# EAGLE design PCB (EAGLE 9.2.2)
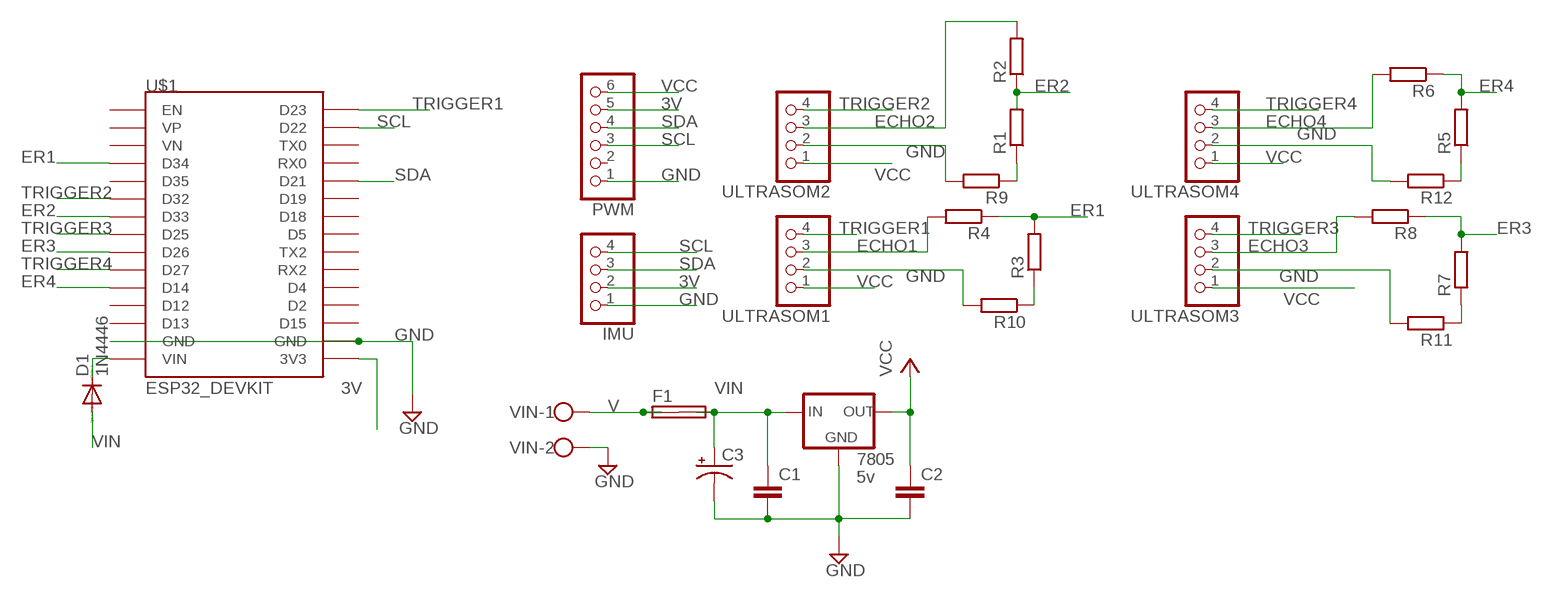
[diagram p0: schematic, sheet 1]

## Parts
7805  5v  78MXXS  [78MXXS]
C1  C-EU025-024X044  [C025-024X044]
C2  C-EU025-024X044  [C025-024X044]
C3  CPOL-USE2-5  [E2-5]
D1  1N4446  [DO35-10]
F1  SHK20L  [SHK20L]
IMU  PINHD-1X4  [1X04]
PWM  PINHD-1X6  [1X06]
R1  R-EU_0207/7  [0207/7]
R2  R-EU_0207/7  [0207/7]
R3  R-EU_0207/7  [0207/7]
R4  R-EU_0207/7  [0207/7]
R5  R-EU_0207/7  [0207/7]
R6  R-EU_0207/7  [0207/7]
R7  R-EU_0207/7  [0207/7]
R8  R-EU_0207/7  [0207/7]
R9  R-EU_0207/7  [0207/7]
R10  R-EU_0207/7  [0207/7]
R11  R-EU_0207/7  [0207/7]
R12  R-EU_0207/7  [0207/7]
U$1  ESP32_DEVKIT  [ESP32_DEVKIT]
ULTRASOM1  PINHD-1X4  [1X04]
ULTRASOM2  PINHD-1X4  [1X04]
ULTRASOM3  PINHD-1X4  [1X04]
ULTRASOM4  PINHD-1X4  [1X04]
VIN  W237-102  [W237-102]

## Nets
3V: IMU.2 PWM.5 U$1.3V3
ECHO1: R4.2 ULTRASOM1.3
ECHO2: R2.2 ULTRASOM2.3
ECHO3: R8.2 ULTRASOM3.3
ECHO4: R6.2 ULTRASOM4.3
ER1: R3.2 R4.1 U$1.D34
ER2: R1.2 R2.1 U$1.D33
ER3: R7.2 R8.1 U$1.D26
ER4: R5.2 R6.1 U$1.D14
GND: 7805.GND C1.2 C2.2 C3.- IMU.1 PWM.1 R9.2 R10.2 R11.2 R12.2 U$1.GND@1(GND) U$1.GND@2(GND) ULTRASOM1.2 ULTRASOM2.2 ULTRASOM3.2 ULTRASOM4.2 VIN.2
N$1: D1.C U$1.VIN
N$3: R5.1 R12.1
N$4: R7.1 R11.1
N$5: R3.1 R10.1
N$6: R1.1 R9.1
SCL: IMU.4 PWM.3 U$1.D22
SDA: IMU.3 PWM.4 U$1.D21
TRIGGER1: U$1.D23 ULTRASOM1.4
TRIGGER2: U$1.D32 ULTRASOM2.4
TRIGGER3: U$1.D25 ULTRASOM3.4
TRIGGER4: U$1.D27 ULTRASOM4.4
V: F1.1A F1.1B VIN.1
VCC: 7805.OUT C2.1 PWM.6 ULTRASOM1.1 ULTRASOM2.1 ULTRASOM3.1 ULTRASOM4.1
VIN: 7805.IN C1.1 C3.+ D1.A F1.2A F1.2B
Unconnected: PWM.2 U$1.D2 U$1.D4 U$1.D5 U$1.D12 U$1.D13 U$1.D15 U$1.D18 U$1.D19 U$1.D35 U$1.EN U$1.RX0 U$1.RX2 U$1.TX0 U$1.TX2 U$1.VN U$1.VP

## Library data of the parts
7805 = v-reg:78MXXS: VOLTAGE REGULATOR
C1 C2 = rcl:C-EU: CAPACITOR, European symbol; SPICEPREFIX: C
C3 = rcl:CPOL-US: POLARIZED CAPACITOR, American symbol; SPICEPREFIX: C
D1 = diode:1N4446: DIODE high speed (Philips)
F1 = fuse:SHK20L: FUSE HOLDER 5 x 20 mm, SH contact, SHH1 Schukat, E1073 Buerklin; OC_FARNELL: unknown; OC_NEWARK: unknown
IMU ULTRASOM1-ULTRASOM4 = pinhead:PINHD-1X4: PIN HEADER
PWM = pinhead:PINHD-1X6: PIN HEADER
R1-R12 = rcl:R-EU_: RESISTOR, European symbol; SPICEPREFIX: R
U$1 = DOIT_ESP32_DEVKIT:ESP32_DEVKIT: ESP32 DEVKIT BOARD
VIN = con-wago-500:W237-102: WAGO SCREW CLAMP; MPN: 237-102; OC_FARNELL: unknown; OC_NEWARK: 70K9898

## Board
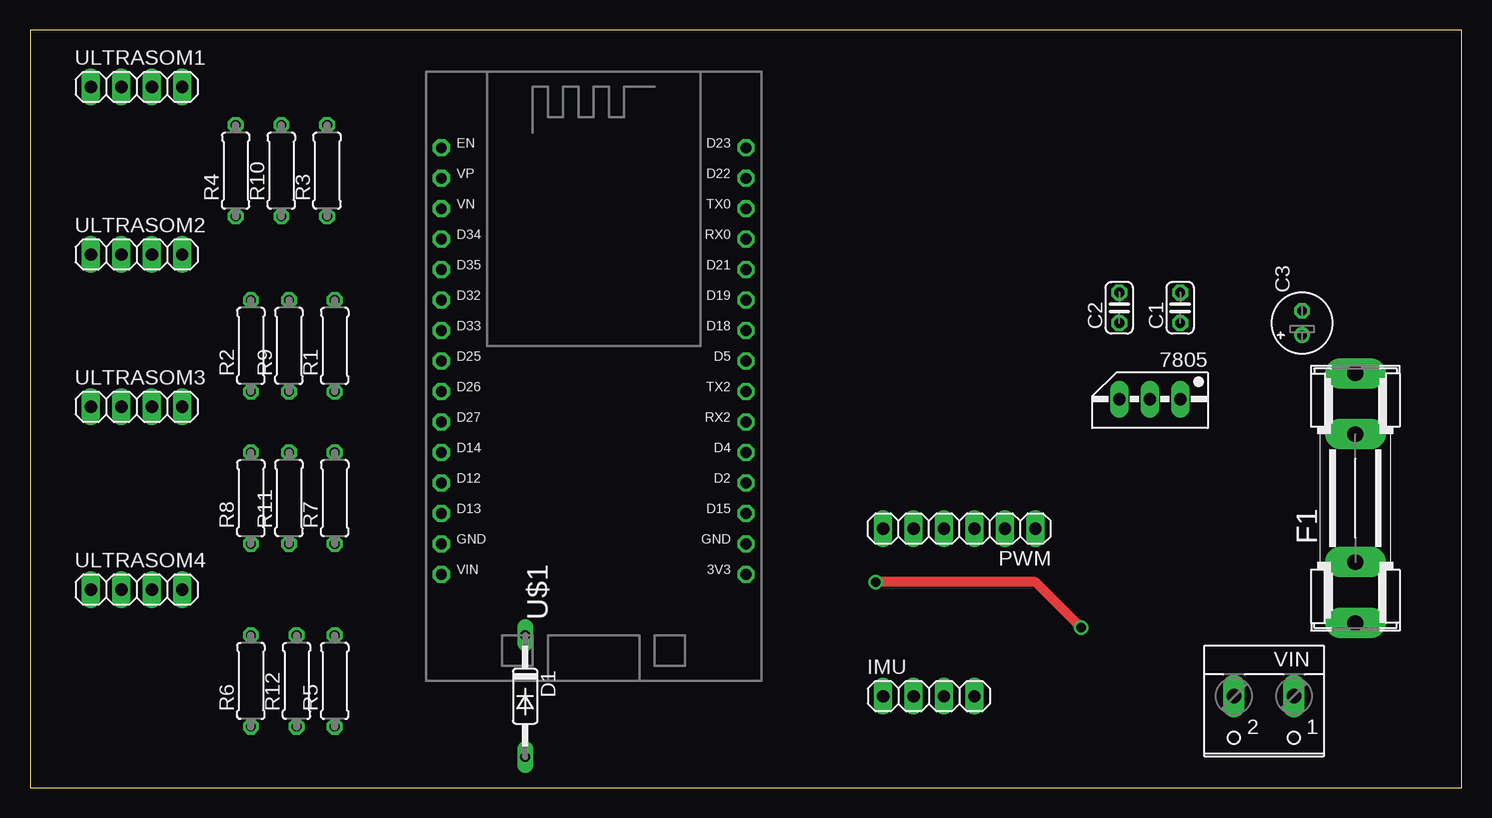
[diagram p1: board, top side]
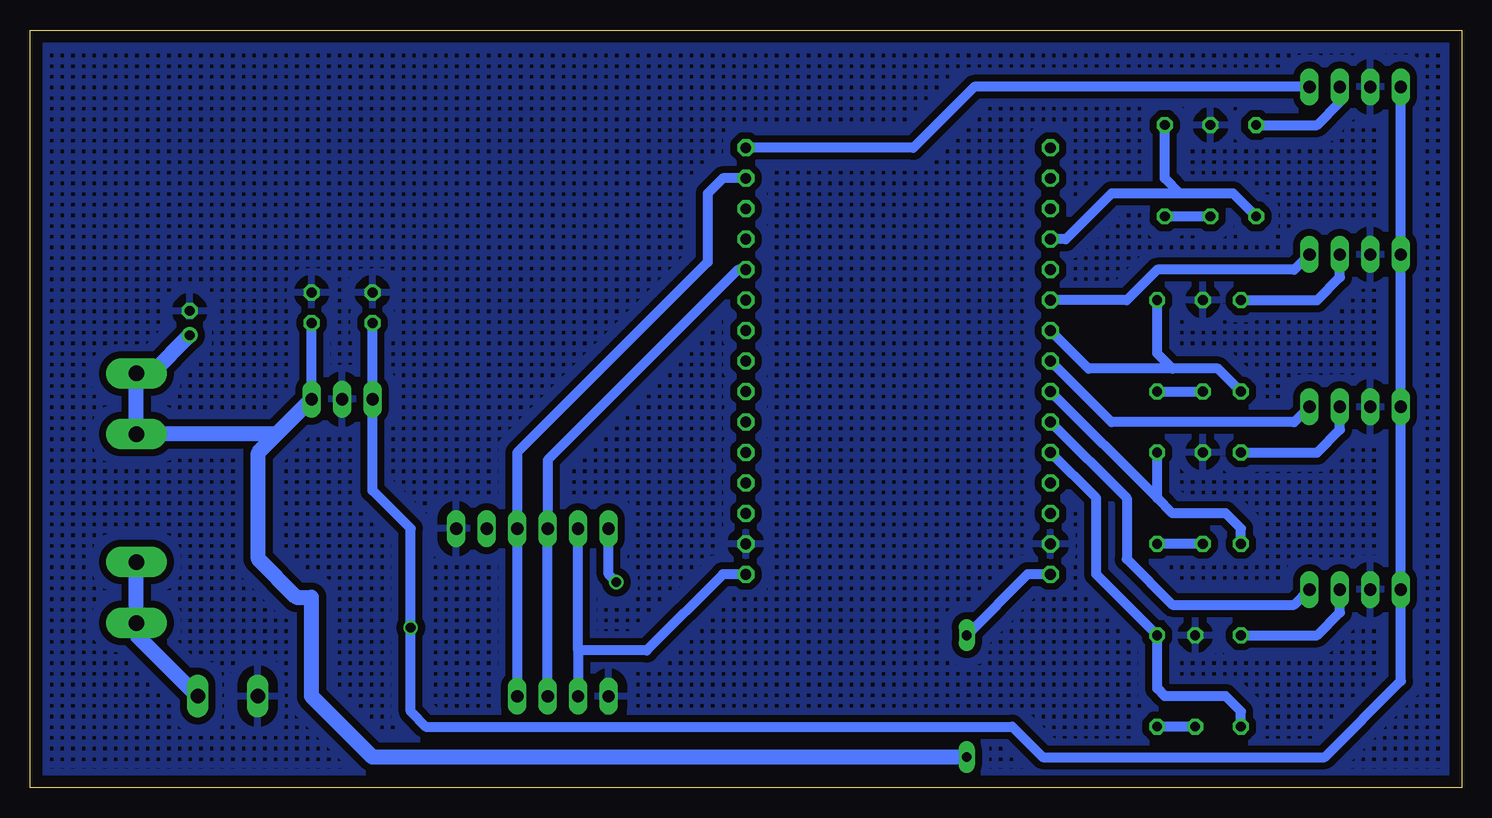
[diagram p2: board, bottom side, seen from below]

Size 119.36 x 63.17 mm. Coordinates in mm from the lower left corner, seen from the top.
Outline: 0,0 119.36,0 119.36,63.17 0,63.17 0,0
Copper layers (1*16): Top 0.035mm / dielectric 1.5mm / Bottom 0.035mm
Design rules "default *": minimum track width 0.8mm, minimum drill 0.8mm, track to track 0.4mm, track to pad 0.4mm, pad to pad 0.4mm, via to via 0.4mm, smd to smd 6mil, copper to edge 40mil, drill to drill 6mil, minimum pad ring 10mil, minimum via ring 8mil, stop-mask expansion 4mil, vias tented up to drill 0mil, thermal gap 0.8mm

### Footprints (pad centres in the part's own frame; a part is rotated, then mirrored left to right if it is on the bottom)
78MXXS = drill 1.016 long: GND 0,-2.54; IN -2.54,-2.54; OUT 2.54,-2.54
C025-024X044 = drill 0.813 octagon: 1 -1.27,0; 2 1.27,0
E2-5 = drill 0.813 pad 1.27: + -1.016,0 | drill 0.813 pad 1.27 octagon: - 1.016,0
DO35-10 = drill 0.813 long: A 5.08,0; C -5.08,0
SHK20L = drill 1.321 pad 2.54 long: 1A -10.414,0; 1B -5.334,0; 2A 10.414,0; 2B 5.334,0
1X04 = drill 1.016 long: 1 -3.81,0; 2 -1.27,0; 3 1.27,0; 4 3.81,0
1X06 = drill 1.016 long: 1 -6.35,0; 2 -3.81,0; 3 -1.27,0; 4 1.27,0; 5 3.81,0; 6 6.35,0
0207/7 = drill 0.813 octagon: 1 -3.81,0; 2 3.81,0
ESP32_DEVKIT = drill 0.9 pad 1.422 octagon: 3V3 11.43,-17.78; D2 11.43,-10.16; D4 11.43,-7.62; D5 11.43,0; D12 -13.97,-10.16; D13 -13.97,-12.7; D14 -13.97,-7.62; D15 11.43,-12.7; D18 11.43,2.54; D19 11.43,5.08; D21 11.43,7.62; D22 11.43,15.24; D23 11.43,17.78; D25 -13.97,0; D26 -13.97,-2.54; D27 -13.97,-5.08; D32 -13.97,5.08; D33 -13.97,2.54; D34 -13.97,10.16; D35 -13.97,7.62; EN -13.97,17.78; GND@1 -13.97,-15.24; GND@2 11.43,-15.24; RX0 11.43,10.16; RX2 11.43,-5.08; TX0 11.43,12.7; TX2 11.43,-2.54; VIN -13.97,-17.78; VN -13.97,12.7; VP -13.97,15.24
W237-102 = drill 1.194 long: 1 -2.5,-1.27; 2 2.5,-1.27

### Placement (x,y rotation side)
7805  93.34,29.84 180 top
C1  95.88,40.01 90 top
C2  90.8,40.01 90 top
C3  106.05,38.73 90 top
D1  41.28,7.62 270 top
F1  110.49,24.13 90 top
IMU  74.93,7.62 0 top
PWM  77.47,21.59 180 top
R1  25.4,36.83 90 top
R2  18.42,36.83 90 top
R3  24.76,51.44 90 top
R4  17.14,51.44 90 top
R5  25.4,8.89 90 top
R6  18.42,8.89 90 top
R7  25.4,24.13 90 top
R8  18.42,24.13 90 top
R9  21.59,36.83 90 top
R10  20.96,51.44 90 top
R11  21.59,24.13 90 top
R12  22.22,8.89 90 top
U$1  48.26,35.56 0 top
ULTRASOM1  8.89,58.42 0 top
ULTRASOM2  8.89,44.45 0 top
ULTRASOM3  8.89,31.75 0 top
ULTRASOM4  8.89,16.51 0 top
VIN  102.87,6.35 180 top

### Tracks (layer width: path | path; a pad name or v marks a point on that pad's centre or on a via)
3V
  Bottom 0.813: U$1.3V3 61.59,17.78 67.94,11.43 73.66,11.43 | 73.66,11.43 IMU.2 | 73.66,11.43 PWM.5
ECHO1
  Bottom 0.813: R4.2 12.07,55.24 10.16,57.15 ULTRASOM1.3
ECHO2
  Bottom 0.813: R2.2 14.61,40.64 12.07,40.64 10.16,42.55 ULTRASOM2.3
ECHO3
  Bottom 0.813: ULTRASOM3.3 10.16,29.84 12.07,27.94 R8.2
ECHO4
  Bottom 0.813: ULTRASOM4.3 10.16,14.61 12.07,12.7 R6.2
ER1
  Bottom 0.813: R4.1 19.05,49.53 23.5,49.53 | 23.5,49.53 24.76,50.8 R3.2 | 23.5,49.53 29.21,49.53 33.02,45.72 U$1.D34
ER2
  Bottom 0.813: R2.1 20.32,34.93 24.13,34.93 | 24.13,34.93 25.4,36.2 R1.2 | 24.13,34.93 31.11,34.93 U$1.D33
ER3
  Bottom 0.813: R8.1 18.42,21.59 19.68,22.86 24.13,22.86 25.4,24.13 | 25.4,24.13 R7.2 | 25.4,24.13 U$1.D26
ER4
  Bottom 0.813: U$1.D14 30.48,24.13 30.48,17.78 R5.2 25.4,8.25 24.76,7.62 19.68,7.62 18.42,6.35 R6.1
GND
  pour Bottom (isolate 0.584, hatched): 0,62.87 0,0 119.38,0 119.38,62.87
N$1
  Bottom 0.813: U$1.VIN 36.19,17.78 D1.C
N$3
  Bottom 0.813: R12.1 R5.1
N$4
  Bottom 0.813: R11.1 R7.1
N$5
  Bottom 0.813: R10.1 R3.1
N$6
  Bottom 0.813: R1.1 R9.1
SCL
  Bottom 0.813: IMU.4 PWM.3 78.74,27.94 62.86,43.81 62.86,49.53 61.59,50.8 U$1.D22
SDA
  Bottom 0.813: IMU.3 PWM.4 76.2,27.3 60.33,43.18 U$1.D21
TRIGGER1
  Bottom 0.813: ULTRASOM1.4 40.64,58.42 45.72,53.34 U$1.D23
TRIGGER2
  Bottom 0.813: ULTRASOM2.4 13.97,43.18 25.4,43.18 27.94,40.64 U$1.D32
TRIGGER3
  Bottom 0.813: ULTRASOM3.4 13.97,30.48 29.21,30.48 U$1.D25
TRIGGER4
  Bottom 0.813: ULTRASOM4.4 13.97,15.24 24.13,15.24 27.94,19.05 27.94,24.13 U$1.D27
V
  Bottom 1.27: 110.49,19.05 F1.1B F1.1A 110.49,12.74 VIN.1
VCC  (via drill 0.8)
  Top 0.813: v87.63,13.34 83.82,17.14 v70.48,17.14
  Bottom 0.813: C2.1 7805.OUT 90.8,24.77 87.63,21.59 v87.63,13.34 87.63,6.35 86.36,5.08 37.47,5.08 34.92,2.54 11.43,2.54 5.08,8.89 ULTRASOM4.1 ULTRASOM3.1 ULTRASOM2.1 ULTRASOM1.1 | v70.48,17.14 71.12,17.78 PWM.6
VIN
  Bottom 0.813: 7805.IN C1.1
  Bottom 1.27: D1.A 90.8,2.54 95.88,7.62 95.88,15.88 97.16,15.88 100.33,19.05 100.33,27.94 98.81,29.46 | 7805.IN 98.81,29.46 | 98.81,29.46 F1.2B F1.2A 109.22,34.54 C3.+